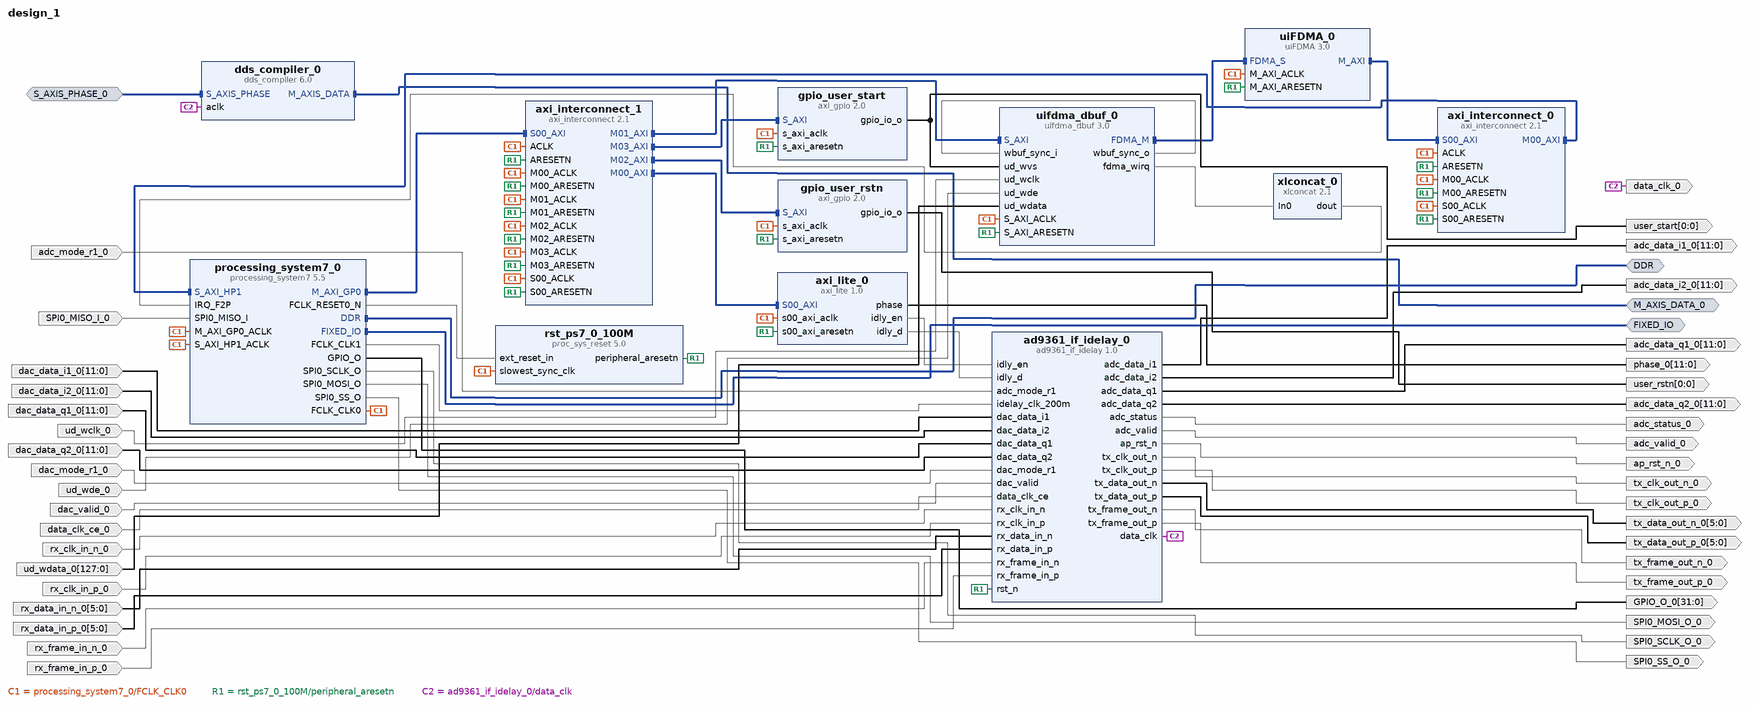
[diagram p0: block diagram of the top level]
# Vivado block design design_1, xc7z020clg484-1, Vivado 2019.2
create_bd_design design_1

create_bd_intf_port -mode Master -vlnv xilinx.com:interface:ddrx_rtl:1.0 DDR
create_bd_intf_port -mode Master -vlnv xilinx.com:display_processing_system7:fixedio_rtl:1.0 FIXED_IO
create_bd_intf_port -mode Slave -vlnv xilinx.com:interface:axis_rtl:1.0 S_AXIS_PHASE_0
set_property -dict [list \
  CONFIG.TDATA_NUM_BYTES 2 \
  CONFIG.TDEST_WIDTH 0 \
  CONFIG.TID_WIDTH 0 \
  CONFIG.TUSER_WIDTH 0 \
  CONFIG.HAS_TREADY 0 \
  CONFIG.HAS_TSTRB 0 \
  CONFIG.HAS_TKEEP 0 \
  CONFIG.HAS_TLAST 0 \
  CONFIG.LAYERED_METADATA undef \
] [get_bd_intf_ports S_AXIS_PHASE_0]
create_bd_intf_port -mode Master -vlnv xilinx.com:interface:axis_rtl:1.0 M_AXIS_DATA_0
create_bd_port -dir O -from 0 -to 0 user_rstn
create_bd_port -dir O -from 0 -to 0 user_start
create_bd_port -dir O -type clk data_clk_0
set_property -dict {CONFIG.ASSOCIATED_BUSIF M_AXIS_DATA_0:S_AXIS_PHASE_0} [get_bd_ports data_clk_0]
create_bd_port -dir O -from 11 -to 0 adc_data_i1_0
create_bd_port -dir O -from 11 -to 0 adc_data_i2_0
create_bd_port -dir O -from 11 -to 0 adc_data_q1_0
create_bd_port -dir O -from 11 -to 0 adc_data_q2_0
create_bd_port -dir I adc_mode_r1_0
create_bd_port -dir O adc_status_0
create_bd_port -dir O adc_valid_0
create_bd_port -dir O -type rst ap_rst_n_0
create_bd_port -dir I -from 11 -to 0 dac_data_i1_0
create_bd_port -dir I -from 11 -to 0 dac_data_i2_0
create_bd_port -dir I -from 11 -to 0 dac_data_q1_0
create_bd_port -dir I -from 11 -to 0 dac_data_q2_0
create_bd_port -dir I dac_mode_r1_0
create_bd_port -dir I dac_valid_0
create_bd_port -dir I data_clk_ce_0
create_bd_port -dir I rx_clk_in_n_0
create_bd_port -dir I rx_clk_in_p_0
create_bd_port -dir I -from 5 -to 0 rx_data_in_n_0
create_bd_port -dir I -from 5 -to 0 rx_data_in_p_0
create_bd_port -dir I rx_frame_in_n_0
create_bd_port -dir I rx_frame_in_p_0
create_bd_port -dir O tx_clk_out_n_0
create_bd_port -dir O tx_clk_out_p_0
create_bd_port -dir O -from 5 -to 0 tx_data_out_n_0
create_bd_port -dir O -from 5 -to 0 tx_data_out_p_0
create_bd_port -dir O tx_frame_out_n_0
create_bd_port -dir O tx_frame_out_p_0
create_bd_port -dir I ud_wclk_0
create_bd_port -dir I ud_wde_0
create_bd_port -dir O -from 31 -to 0 GPIO_O_0
create_bd_port -dir O SPI0_SCLK_O_0
create_bd_port -dir O SPI0_MOSI_O_0
create_bd_port -dir I SPI0_MISO_I_0
create_bd_port -dir O SPI0_SS_O_0
create_bd_port -dir O -from 11 -to 0 phase_0
create_bd_port -dir I -from 127 -to 0 ud_wdata_0

create_bd_cell -type ip -vlnv xilinx.com:ip:processing_system7:5.5 processing_system7_0
set_property -dict [list \
  CONFIG.PCW_ENET0_ENET0_IO {MIO 16 .. 27} \
  CONFIG.PCW_ENET0_GRP_MDIO_ENABLE 1 \
  CONFIG.PCW_ENET0_GRP_MDIO_IO {MIO 52 .. 53} \
  CONFIG.PCW_ENET0_PERIPHERAL_ENABLE 1 \
  CONFIG.PCW_ENET0_RESET_ENABLE 0 \
  CONFIG.PCW_ENET_RESET_ENABLE 1 \
  CONFIG.PCW_ENET_RESET_SELECT {Share reset pin} \
  CONFIG.PCW_EN_CLK1_PORT 1 \
  CONFIG.PCW_FCLK_CLK1_BUF TRUE \
  CONFIG.PCW_FPGA0_PERIPHERAL_FREQMHZ 100 \
  CONFIG.PCW_FPGA1_PERIPHERAL_FREQMHZ 200 \
  CONFIG.PCW_FPGA_FCLK1_ENABLE 1 \
  CONFIG.PCW_GPIO_EMIO_GPIO_ENABLE 1 \
  CONFIG.PCW_GPIO_EMIO_GPIO_IO 32 \
  CONFIG.PCW_GPIO_EMIO_GPIO_WIDTH 32 \
  CONFIG.PCW_GPIO_MIO_GPIO_ENABLE 1 \
  CONFIG.PCW_GPIO_MIO_GPIO_IO MIO \
  CONFIG.PCW_I2C_RESET_ENABLE 0 \
  CONFIG.PCW_IRQ_F2P_INTR 1 \
  CONFIG.PCW_PRESET_BANK1_VOLTAGE {LVCMOS 1.8V} \
  CONFIG.PCW_QSPI_GRP_FBCLK_ENABLE 1 \
  CONFIG.PCW_QSPI_GRP_FBCLK_IO {MIO 8} \
  CONFIG.PCW_QSPI_GRP_SINGLE_SS_ENABLE 1 \
  CONFIG.PCW_QSPI_GRP_SINGLE_SS_IO {MIO 1 .. 6} \
  CONFIG.PCW_QSPI_PERIPHERAL_ENABLE 1 \
  CONFIG.PCW_QSPI_PERIPHERAL_FREQMHZ 125 \
  CONFIG.PCW_QSPI_QSPI_IO {MIO 1 .. 6} \
  CONFIG.PCW_SD0_GRP_CD_ENABLE 1 \
  CONFIG.PCW_SD0_GRP_CD_IO {MIO 47} \
  CONFIG.PCW_SD0_GRP_WP_ENABLE 0 \
  CONFIG.PCW_SD0_PERIPHERAL_ENABLE 1 \
  CONFIG.PCW_SD0_SD0_IO {MIO 40 .. 45} \
  CONFIG.PCW_SD1_GRP_CD_ENABLE 1 \
  CONFIG.PCW_SD1_GRP_CD_IO {MIO 9} \
  CONFIG.PCW_SD1_PERIPHERAL_ENABLE 1 \
  CONFIG.PCW_SD1_SD1_IO {MIO 10 .. 15} \
  CONFIG.PCW_SDIO_PERIPHERAL_FREQMHZ 100 \
  CONFIG.PCW_SINGLE_QSPI_DATA_MODE x4 \
  CONFIG.PCW_SPI0_PERIPHERAL_ENABLE 1 \
  CONFIG.PCW_SPI0_SPI0_IO EMIO \
  CONFIG.PCW_UART1_PERIPHERAL_ENABLE 1 \
  CONFIG.PCW_UART1_UART1_IO {MIO 48 .. 49} \
  CONFIG.PCW_UART_PERIPHERAL_FREQMHZ 100 \
  CONFIG.PCW_UIPARAM_DDR_PARTNO {MT41K128M16 JT-125} \
  CONFIG.PCW_USB0_PERIPHERAL_ENABLE 1 \
  CONFIG.PCW_USB0_RESET_ENABLE 0 \
  CONFIG.PCW_USB0_USB0_IO {MIO 28 .. 39} \
  CONFIG.PCW_USB_RESET_ENABLE 1 \
  CONFIG.PCW_USB_RESET_SELECT {Share reset pin} \
  CONFIG.PCW_USE_FABRIC_INTERRUPT 1 \
  CONFIG.PCW_USE_S_AXI_HP1 1 \
] [get_bd_cells processing_system7_0]
# 213 more settings of processing_system7_0 are not shown: defaults, MIO pin electricals, DDR timing, and values the tool derives
create_bd_cell -type ip -vlnv xilinx.com:ip:xlconcat:2.1 xlconcat_0
create_bd_cell -type ip -vlnv xilinx.com:ip:axi_interconnect:2.1 axi_interconnect_0
set_property -dict {CONFIG.NUM_MI 1} [get_bd_cells axi_interconnect_0]
create_bd_cell -type ip -vlnv xilinx.com:user:uiFDMA:3.0 uiFDMA_0
create_bd_cell -type ip -vlnv xilinx.com:user:uifdma_dbuf:3.0 uifdma_dbuf_0
set_property -dict [list \
  CONFIG.AXI_DATA_WIDTH 128 \
  CONFIG.ENABLE_READ false \
  CONFIG.VIDEO_ENABLE false \
  CONFIG.W_BASEADDR 0x08000000 \
  CONFIG.W_DATAWIDTH 128 \
  CONFIG.W_DSIZEBITS 23 \
  CONFIG.W_XSIZE 2048 \
  CONFIG.W_XSTRIDE 2048 \
  CONFIG.W_YSIZE 32 \
] [get_bd_cells uifdma_dbuf_0]
create_bd_cell -type ip -vlnv xilinx.com:ip:axi_interconnect:2.1 axi_interconnect_1
set_property -dict {CONFIG.NUM_MI 4} [get_bd_cells axi_interconnect_1]
create_bd_cell -type ip -vlnv xilinx.com:user:ad9361_if_idelay:1.0 ad9361_if_idelay_0
create_bd_cell -type ip -vlnv xilinx.com:user:axi_lite:1.0 axi_lite_0
create_bd_cell -type ip -vlnv xilinx.com:ip:axi_gpio:2.0 gpio_user_rstn
set_property -dict {CONFIG.C_GPIO_WIDTH 1} [get_bd_cells gpio_user_rstn]
create_bd_cell -type ip -vlnv xilinx.com:ip:axi_gpio:2.0 gpio_user_start
set_property -dict {CONFIG.C_GPIO_WIDTH 1} [get_bd_cells gpio_user_start]
create_bd_cell -type ip -vlnv xilinx.com:ip:proc_sys_reset:5.0 rst_ps7_0_100M
create_bd_cell -type ip -vlnv xilinx.com:ip:dds_compiler:6.0 dds_compiler_0
set_property -dict [list \
  CONFIG.DATA_Has_TLAST Not_Required \
  CONFIG.Has_Phase_Out false \
  CONFIG.Latency 6 \
  CONFIG.M_DATA_Has_TUSER Not_Required \
  CONFIG.Noise_Shaping None \
  CONFIG.Output_Frequency1 0 \
  CONFIG.Output_Width 12 \
  CONFIG.PINC1 0 \
  CONFIG.Parameter_Entry Hardware_Parameters \
  CONFIG.PartsPresent SIN_COS_LUT_only \
  CONFIG.Phase_Width 12 \
  CONFIG.S_PHASE_Has_TUSER Not_Required \
] [get_bd_cells dds_compiler_0]

# ---- connections ----

connect_bd_intf_net [get_bd_intf_pins gpio_user_start/S_AXI] [get_bd_intf_pins axi_interconnect_1/M03_AXI]
connect_bd_intf_net [get_bd_intf_pins axi_interconnect_0/M00_AXI] [get_bd_intf_pins processing_system7_0/S_AXI_HP1]
connect_bd_intf_net [get_bd_intf_pins gpio_user_rstn/S_AXI] [get_bd_intf_pins axi_interconnect_1/M02_AXI]
connect_bd_intf_net [get_bd_intf_ports DDR] [get_bd_intf_pins processing_system7_0/DDR]
connect_bd_intf_net [get_bd_intf_pins uifdma_dbuf_0/FDMA_M] [get_bd_intf_pins uiFDMA_0/FDMA_S]
connect_bd_intf_net [get_bd_intf_pins axi_lite_0/S00_AXI] [get_bd_intf_pins axi_interconnect_1/M00_AXI]
connect_bd_intf_net [get_bd_intf_ports FIXED_IO] [get_bd_intf_pins processing_system7_0/FIXED_IO]
connect_bd_intf_net -intf_net S_AXIS_PHASE_0_1 [get_bd_intf_ports S_AXIS_PHASE_0] [get_bd_intf_pins dds_compiler_0/S_AXIS_PHASE]
connect_bd_intf_net [get_bd_intf_pins uiFDMA_0/M_AXI] [get_bd_intf_pins axi_interconnect_0/S00_AXI]
connect_bd_intf_net [get_bd_intf_pins axi_interconnect_1/S00_AXI] [get_bd_intf_pins processing_system7_0/M_AXI_GP0]
connect_bd_intf_net [get_bd_intf_ports M_AXIS_DATA_0] [get_bd_intf_pins dds_compiler_0/M_AXIS_DATA]
connect_bd_intf_net [get_bd_intf_pins uifdma_dbuf_0/S_AXI] [get_bd_intf_pins axi_interconnect_1/M01_AXI]
connect_bd_net [get_bd_pins xlconcat_0/dout] [get_bd_pins processing_system7_0/IRQ_F2P]
connect_bd_net [get_bd_pins axi_lite_0/idly_en] [get_bd_pins ad9361_if_idelay_0/idly_en]
connect_bd_net [get_bd_pins axi_lite_0/idly_d] [get_bd_pins ad9361_if_idelay_0/idly_d]
connect_bd_net [get_bd_pins processing_system7_0/FCLK_CLK1] [get_bd_pins ad9361_if_idelay_0/idelay_clk_200m]
connect_bd_net [get_bd_pins uifdma_dbuf_0/fdma_wirq] [get_bd_pins xlconcat_0/In0]
connect_bd_net [get_bd_pins processing_system7_0/FCLK_CLK0] \
  [get_bd_pins gpio_user_rstn/s_axi_aclk] [get_bd_pins axi_interconnect_1/M02_ACLK] \
  [get_bd_pins rst_ps7_0_100M/slowest_sync_clk] [get_bd_pins gpio_user_start/s_axi_aclk] \
  [get_bd_pins axi_interconnect_1/M03_ACLK] [get_bd_pins axi_interconnect_0/ACLK] [get_bd_pins axi_interconnect_0/M00_ACLK] \
  [get_bd_pins processing_system7_0/S_AXI_HP1_ACLK] [get_bd_pins axi_interconnect_0/S00_ACLK] \
  [get_bd_pins uiFDMA_0/M_AXI_ACLK] [get_bd_pins axi_interconnect_1/ACLK] [get_bd_pins axi_interconnect_1/M00_ACLK] \
  [get_bd_pins axi_lite_0/s00_axi_aclk] [get_bd_pins axi_interconnect_1/M01_ACLK] [get_bd_pins uifdma_dbuf_0/S_AXI_ACLK] \
  [get_bd_pins axi_interconnect_1/S00_ACLK] [get_bd_pins processing_system7_0/M_AXI_GP0_ACLK]
connect_bd_net [get_bd_pins processing_system7_0/FCLK_RESET0_N] [get_bd_pins rst_ps7_0_100M/ext_reset_in]
connect_bd_net [get_bd_pins rst_ps7_0_100M/peripheral_aresetn] \
  [get_bd_pins gpio_user_rstn/s_axi_aresetn] [get_bd_pins axi_interconnect_1/M02_ARESETN] \
  [get_bd_pins gpio_user_start/s_axi_aresetn] [get_bd_pins axi_interconnect_1/M03_ARESETN] \
  [get_bd_pins axi_interconnect_0/ARESETN] [get_bd_pins axi_interconnect_0/M00_ARESETN] \
  [get_bd_pins axi_interconnect_0/S00_ARESETN] [get_bd_pins uiFDMA_0/M_AXI_ARESETN] [get_bd_pins axi_interconnect_1/ARESETN] \
  [get_bd_pins axi_interconnect_1/M00_ARESETN] [get_bd_pins axi_lite_0/s00_axi_aresetn] \
  [get_bd_pins axi_interconnect_1/M01_ARESETN] [get_bd_pins uifdma_dbuf_0/S_AXI_ARESETN] \
  [get_bd_pins axi_interconnect_1/S00_ARESETN] [get_bd_pins ad9361_if_idelay_0/rst_n]
connect_bd_net [get_bd_pins gpio_user_rstn/gpio_io_o] [get_bd_ports user_rstn]
connect_bd_net [get_bd_pins gpio_user_start/gpio_io_o] [get_bd_ports user_start] [get_bd_pins uifdma_dbuf_0/ud_wvs]
connect_bd_net [get_bd_pins ad9361_if_idelay_0/data_clk] [get_bd_ports data_clk_0] [get_bd_pins dds_compiler_0/aclk]
connect_bd_net [get_bd_pins ad9361_if_idelay_0/adc_data_i1] [get_bd_ports adc_data_i1_0]
connect_bd_net [get_bd_pins ad9361_if_idelay_0/adc_data_i2] [get_bd_ports adc_data_i2_0]
connect_bd_net [get_bd_pins ad9361_if_idelay_0/adc_data_q1] [get_bd_ports adc_data_q1_0]
connect_bd_net [get_bd_pins ad9361_if_idelay_0/adc_data_q2] [get_bd_ports adc_data_q2_0]
connect_bd_net -net adc_mode_r1_0_1 [get_bd_ports adc_mode_r1_0] [get_bd_pins ad9361_if_idelay_0/adc_mode_r1]
connect_bd_net [get_bd_pins ad9361_if_idelay_0/adc_status] [get_bd_ports adc_status_0]
connect_bd_net [get_bd_pins ad9361_if_idelay_0/adc_valid] [get_bd_ports adc_valid_0]
connect_bd_net [get_bd_pins ad9361_if_idelay_0/ap_rst_n] [get_bd_ports ap_rst_n_0]
connect_bd_net -net dac_data_i1_0_1 [get_bd_ports dac_data_i1_0] [get_bd_pins ad9361_if_idelay_0/dac_data_i1]
connect_bd_net -net dac_data_i2_0_1 [get_bd_ports dac_data_i2_0] [get_bd_pins ad9361_if_idelay_0/dac_data_i2]
connect_bd_net -net dac_data_q1_0_1 [get_bd_ports dac_data_q1_0] [get_bd_pins ad9361_if_idelay_0/dac_data_q1]
connect_bd_net -net dac_data_q2_0_1 [get_bd_ports dac_data_q2_0] [get_bd_pins ad9361_if_idelay_0/dac_data_q2]
connect_bd_net -net dac_mode_r1_0_1 [get_bd_ports dac_mode_r1_0] [get_bd_pins ad9361_if_idelay_0/dac_mode_r1]
connect_bd_net -net dac_valid_0_1 [get_bd_ports dac_valid_0] [get_bd_pins ad9361_if_idelay_0/dac_valid]
connect_bd_net -net data_clk_ce_0_1 [get_bd_ports data_clk_ce_0] [get_bd_pins ad9361_if_idelay_0/data_clk_ce]
connect_bd_net -net rx_clk_in_n_0_1 [get_bd_ports rx_clk_in_n_0] [get_bd_pins ad9361_if_idelay_0/rx_clk_in_n]
connect_bd_net -net rx_clk_in_p_0_1 [get_bd_ports rx_clk_in_p_0] [get_bd_pins ad9361_if_idelay_0/rx_clk_in_p]
connect_bd_net -net rx_data_in_n_0_1 [get_bd_ports rx_data_in_n_0] [get_bd_pins ad9361_if_idelay_0/rx_data_in_n]
connect_bd_net -net rx_data_in_p_0_1 [get_bd_ports rx_data_in_p_0] [get_bd_pins ad9361_if_idelay_0/rx_data_in_p]
connect_bd_net -net rx_frame_in_n_0_1 [get_bd_ports rx_frame_in_n_0] [get_bd_pins ad9361_if_idelay_0/rx_frame_in_n]
connect_bd_net -net rx_frame_in_p_0_1 [get_bd_ports rx_frame_in_p_0] [get_bd_pins ad9361_if_idelay_0/rx_frame_in_p]
connect_bd_net [get_bd_pins ad9361_if_idelay_0/tx_clk_out_n] [get_bd_ports tx_clk_out_n_0]
connect_bd_net [get_bd_pins ad9361_if_idelay_0/tx_clk_out_p] [get_bd_ports tx_clk_out_p_0]
connect_bd_net [get_bd_pins ad9361_if_idelay_0/tx_data_out_n] [get_bd_ports tx_data_out_n_0]
connect_bd_net [get_bd_pins ad9361_if_idelay_0/tx_data_out_p] [get_bd_ports tx_data_out_p_0]
connect_bd_net [get_bd_pins ad9361_if_idelay_0/tx_frame_out_n] [get_bd_ports tx_frame_out_n_0]
connect_bd_net [get_bd_pins ad9361_if_idelay_0/tx_frame_out_p] [get_bd_ports tx_frame_out_p_0]
connect_bd_net [get_bd_pins uifdma_dbuf_0/wbuf_sync_o] [get_bd_pins uifdma_dbuf_0/wbuf_sync_i]
connect_bd_net -net ud_wclk_0_1 [get_bd_ports ud_wclk_0] [get_bd_pins uifdma_dbuf_0/ud_wclk]
connect_bd_net -net ud_wde_0_1 [get_bd_ports ud_wde_0] [get_bd_pins uifdma_dbuf_0/ud_wde]
connect_bd_net [get_bd_pins processing_system7_0/GPIO_O] [get_bd_ports GPIO_O_0]
connect_bd_net [get_bd_pins processing_system7_0/SPI0_SCLK_O] [get_bd_ports SPI0_SCLK_O_0]
connect_bd_net [get_bd_pins processing_system7_0/SPI0_MOSI_O] [get_bd_ports SPI0_MOSI_O_0]
connect_bd_net -net SPI0_MISO_I_0_1 [get_bd_ports SPI0_MISO_I_0] [get_bd_pins processing_system7_0/SPI0_MISO_I]
connect_bd_net [get_bd_pins processing_system7_0/SPI0_SS_O] [get_bd_ports SPI0_SS_O_0]
connect_bd_net [get_bd_pins axi_lite_0/phase] [get_bd_ports phase_0]
connect_bd_net -net ud_wdata_0_1 [get_bd_ports ud_wdata_0] [get_bd_pins uifdma_dbuf_0/ud_wdata]

# ---- address map ----
assign_bd_address -offset 0x41200000 -range 64K -target_address_space [get_bd_addr_spaces processing_system7_0/Data] [get_bd_addr_segs gpio_user_rstn/S_AXI/Reg]
assign_bd_address -offset 0x41210000 -range 64K -target_address_space [get_bd_addr_spaces processing_system7_0/Data] [get_bd_addr_segs gpio_user_start/S_AXI/Reg]
assign_bd_address -offset 0x43C00000 -range 64K -target_address_space [get_bd_addr_spaces processing_system7_0/Data] [get_bd_addr_segs uifdma_dbuf_0/S_AXI/reg0]
assign_bd_address -offset 0x43C10000 -range 64K -target_address_space [get_bd_addr_spaces processing_system7_0/Data] [get_bd_addr_segs axi_lite_0/S00_AXI/S00_AXI_reg]
assign_bd_address -offset 0x00000000 -range 512M -target_address_space [get_bd_addr_spaces uiFDMA_0/M_AXI] [get_bd_addr_segs processing_system7_0/S_AXI_HP1/HP1_DDR_LOWOCM]

validate_bd_design
save_bd_design
